# Altium schematic sheet Analog_Channel.SchDoc
size A4; SheetNumber: 2; SheetTotal: 9
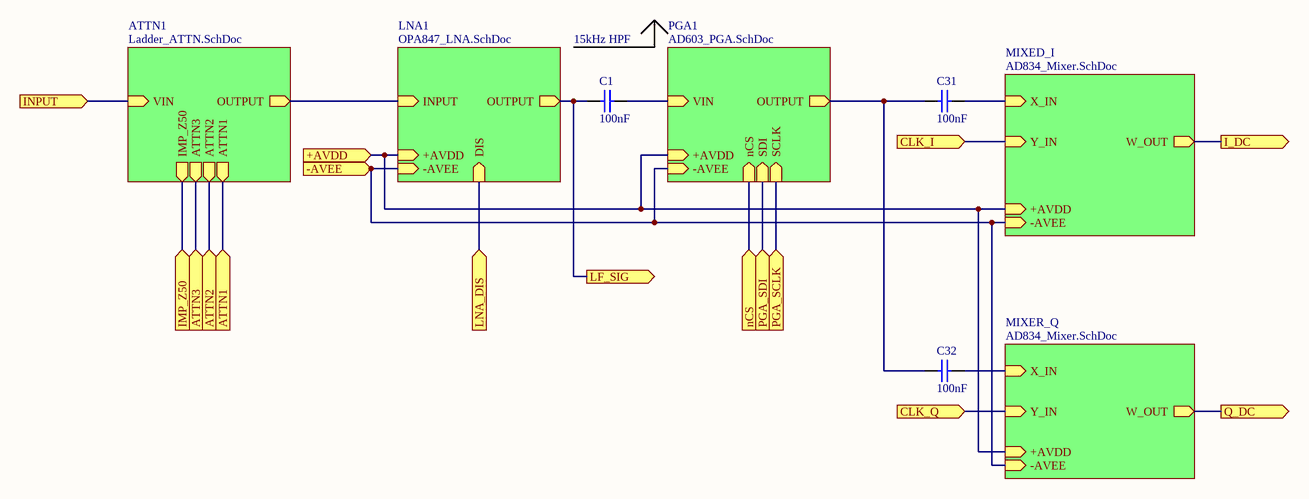
[diagram p0: Analog_Channel.SchDoc]

## Parts
C1  100nF  [0805_C]
C31  100nF  [0805_C]
C32  100nF  [0805_C]

## Sub-sheets
ATTN1 = Ladder_ATTN.SchDoc: OUTPUT (out), VIN (in), ATTN1 (out), ATTN2 (out), ATTN3 (out), IMP_Z50 (out)
LNA1 = OPA847_LNA.SchDoc: INPUT (in), OUTPUT (out), DIS (in), +AVDD (in), -AVEE (in)
MIXED_I = AD834_Mixer.SchDoc: X_IN (in), Y_IN (in), W_OUT (out), +AVDD (in), -AVEE (in)
MIXER_Q = AD834_Mixer.SchDoc: X_IN (in), Y_IN (in), W_OUT (out), +AVDD (in), -AVEE (in)
PGA1 = AD603_PGA.SchDoc: OUTPUT (out), nCS (in), SDI (in), SCLK (in), VIN (in), +AVDD (in), -AVEE (in)

## Ports
+AVDD (in), -AVEE (in), ATTN1 (in), ATTN2 (in), ATTN3 (in), CLK_I (in), CLK_Q (in), I_DC (out), IMP_Z50 (in), INPUT (in), LF_SIG (out), LNA_DIS (in), nCS (in), PGA_SCLK (in), PGA_SDI (in), Q_DC (out)

## Nets
+AVDD: port +AVDD, sheet LNA1/+AVDD, sheet PGA1/+AVDD, sheet MIXER_Q/+AVDD, sheet MIXED_I/+AVDD
-AVEE: port -AVEE, sheet LNA1/-AVEE, sheet PGA1/-AVEE, sheet MIXER_Q/-AVEE, sheet MIXED_I/-AVEE
ATTN1: port ATTN1, sheet ATTN1/ATTN1
ATTN2: port ATTN2, sheet ATTN1/ATTN2
ATTN3: port ATTN3, sheet ATTN1/ATTN3
CLK_I: port CLK_I, sheet MIXED_I/Y_IN
CLK_Q: port CLK_Q, sheet MIXER_Q/Y_IN
I_DC: port I_DC, sheet MIXED_I/W_OUT
IMP_Z50: port IMP_Z50, sheet ATTN1/IMP_Z50
INPUT: port INPUT, sheet ATTN1/VIN
LF_SIG: C1.1 ; port LF_SIG, sheet LNA1/OUTPUT
LNA_DIS: port LNA_DIS, sheet LNA1/DIS
nCS: port nCS, sheet PGA1/nCS
PGA_SCLK: port PGA_SCLK, sheet PGA1/SCLK
PGA_SDI: port PGA_SDI, sheet PGA1/SDI
Q_DC: port Q_DC, sheet MIXER_Q/W_OUT
NetC1_2: C1.2 ; sheet PGA1/VIN
NetC31_1: C31.1 C32.1 ; sheet PGA1/OUTPUT
NetC31_2: C31.2 ; sheet MIXED_I/X_IN
NetC32_2: C32.2 ; sheet MIXER_Q/X_IN
(unnamed): sheet LNA1/INPUT, sheet ATTN1/OUTPUT

## Notes on the sheet
- 15kHz HPF

## Library data of the parts
C1 C31 C32 = 0805 100nF(104) 10% 50V: 贴片电容; ComponentLink1Description: 供应商链接; ComponentLink1URL: http://www.szlcsc.com/product/details_50686.html; Package: 0805; Supplier: LC; SuppliersPartNumber: C49678